# Altium project NES Console.PrjPCB
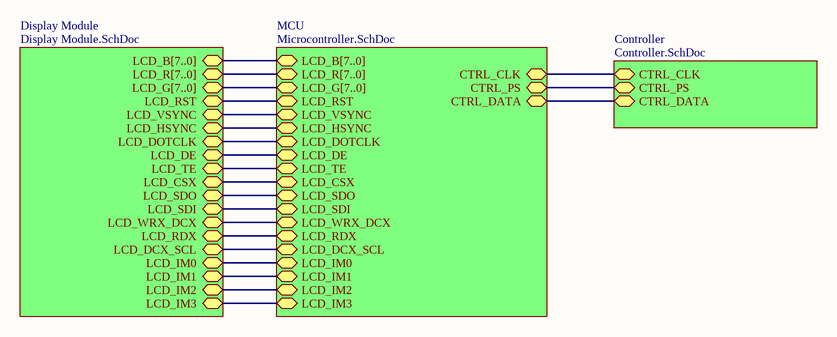
[diagram p0: System Diagram.SchDoc]
4 sheets, 101 parts. Net scope: hierarchical (ports join the sheet entries above them; power ports are global).
Board file: NES Emulator PCB.PcbDoc
Sheets:
  System Diagram.SchDoc
    MCU = Microcontroller.SchDoc
    Controller = Controller.SchDoc
    Display Module = Display Module.SchDoc

## Sheet System Diagram.SchDoc
size A

### Sub-sheets
Controller = Controller.SchDoc: CTRL_CLK (bidir), CTRL_PS (bidir), CTRL_DATA (bidir)
Display Module = Display Module.SchDoc: LCD_B[7..0] (bidir), LCD_R[7..0] (bidir), LCD_G[7..0] (bidir), LCD_RST (bidir), LCD_VSYNC (bidir), LCD_HSYNC (bidir), LCD_DOTCLK (bidir), LCD_DE (bidir), LCD_TE (bidir), LCD_CSX (bidir), LCD_SDO (bidir), LCD_SDI (bidir), LCD_WRX_DCX (bidir), LCD_RDX (bidir), LCD_DCX_SCL (bidir), LCD_IM0 (bidir), LCD_IM1 (bidir), LCD_IM2 (bidir), LCD_IM3 (bidir)
MCU = Microcontroller.SchDoc: LCD_B[7..0] (bidir), LCD_R[7..0] (bidir), LCD_G[7..0] (bidir), LCD_RST (bidir), LCD_VSYNC (bidir), LCD_HSYNC (bidir), LCD_DOTCLK (bidir), LCD_DE (bidir), LCD_TE (bidir), LCD_CSX (bidir), LCD_SDO (bidir), LCD_SDI (bidir), LCD_WRX_DCX (bidir), LCD_RDX (bidir), LCD_DCX_SCL (bidir), LCD_IM0 (bidir), LCD_IM1 (bidir), LCD_IM2 (bidir), LCD_IM3 (bidir), CTRL_PS (bidir), CTRL_CLK (bidir), CTRL_DATA (bidir)

### Nets
DOTCLK: sheet MCU/LCD_DOTCLK, sheet Display Module/LCD_DOTCLK
LCD_CSX: sheet MCU/LCD_CSX, sheet Display Module/LCD_CSX
LCD_DCX: sheet MCU/LCD_DCX_SCL, sheet Display Module/LCD_DCX_SCL
LCD_DE: sheet MCU/LCD_DE, sheet Display Module/LCD_DE
LCD_HSYNC: sheet MCU/LCD_HSYNC, sheet Display Module/LCD_HSYNC
LCD_IM0: sheet MCU/LCD_IM0, sheet Display Module/LCD_IM0
LCD_IM1: sheet MCU/LCD_IM1, sheet Display Module/LCD_IM1
LCD_IM2: sheet MCU/LCD_IM2, sheet Display Module/LCD_IM2
LCD_IM3: sheet MCU/LCD_IM3, sheet Display Module/LCD_IM3
LCD_RDX: sheet MCU/LCD_RDX, sheet Display Module/LCD_RDX
LCD_RST: sheet MCU/LCD_RST, sheet Display Module/LCD_RST
LCD_SDI: sheet MCU/LCD_SDI, sheet Display Module/LCD_SDI
LCD_SDO: sheet MCU/LCD_SDO, sheet Display Module/LCD_SDO
LCD_TE: sheet MCU/LCD_TE, sheet Display Module/LCD_TE
LCD_VSYNC: sheet MCU/LCD_VSYNC, sheet Display Module/LCD_VSYNC
LCD_WRX: sheet MCU/LCD_WRX_DCX, sheet Display Module/LCD_WRX_DCX
PE2: sheet MCU/CTRL_CLK, sheet Controller/CTRL_CLK
PE4: sheet MCU/CTRL_PS, sheet Controller/CTRL_PS
NetP9_1: sheet MCU/CTRL_DATA, sheet Controller/CTRL_DATA

### Buses and harness runs
bus sheet Display Module/LCD_B[7..0] = sheet MCU/LCD_B[7..0]
bus sheet Display Module/LCD_G[7..0] = sheet MCU/LCD_G[7..0]
bus sheet Display Module/LCD_R[7..0] = sheet MCU/LCD_R[7..0]

## Sheet Microcontroller.SchDoc
size A3
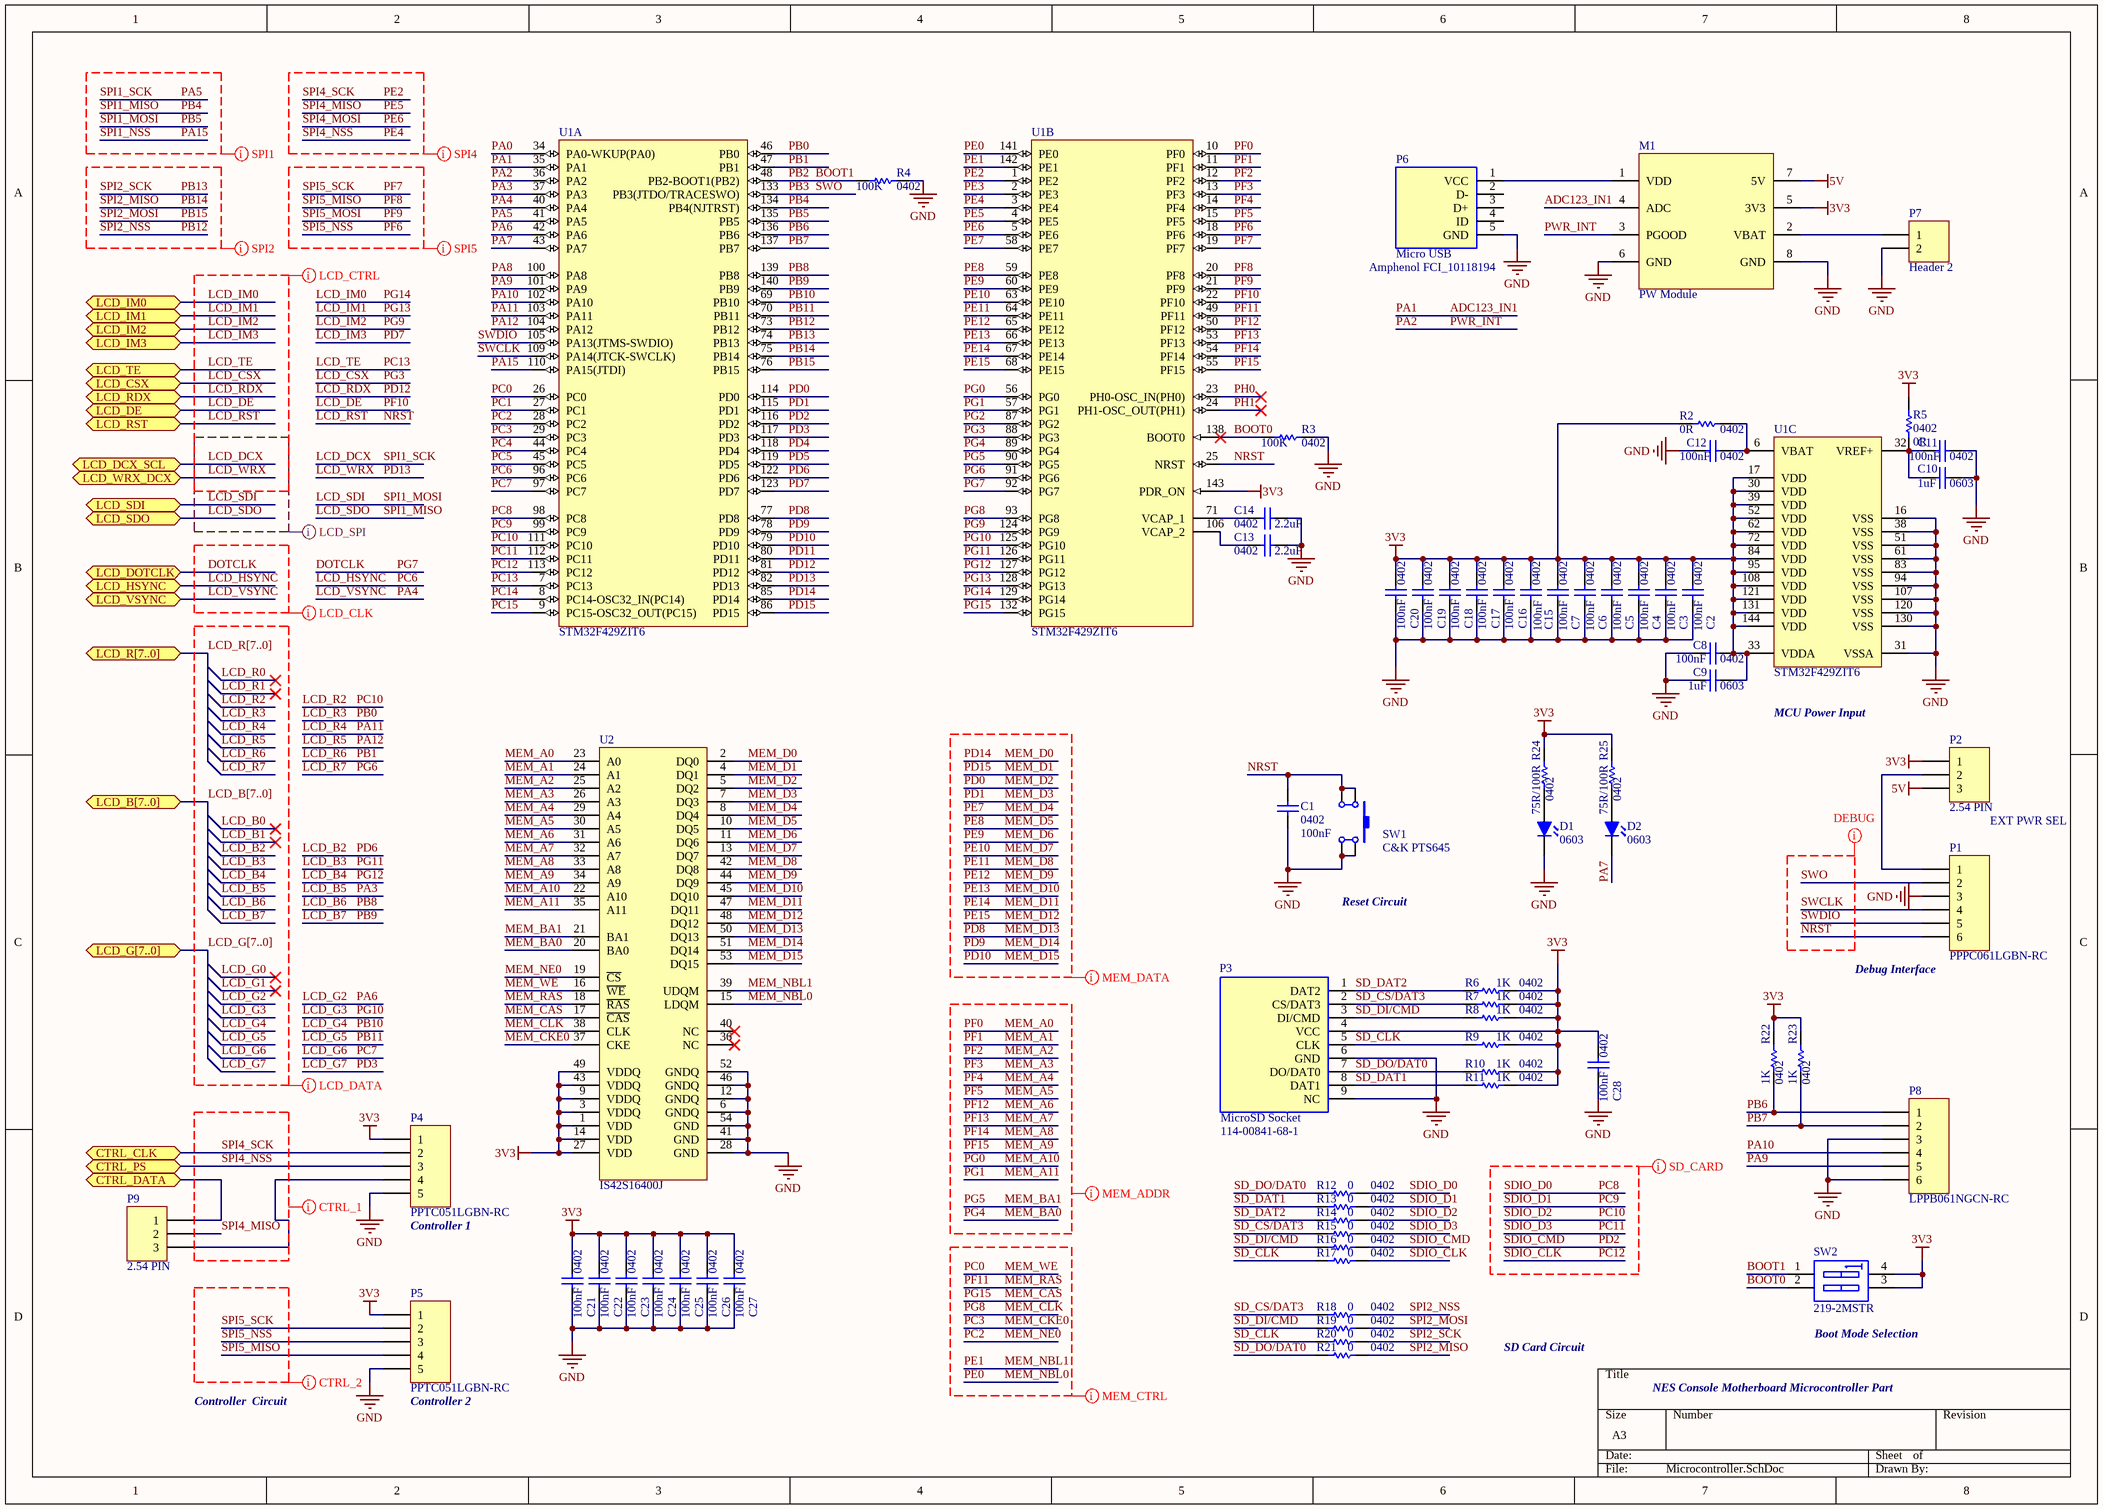
[diagram p1: Microcontroller.SchDoc]

### Parts
C1  0402  value 100nF  [CAPC1005X07N]
C2  0402  value 100nF  [CAPC1005X07N]
C3  0402  value 100nF  [CAPC1005X07N]
C4  0402  value 100nF  [CAPC1005X07N]
C5  0402  value 100nF  [CAPC1005X07N]
C6  0402  value 100nF  [CAPC1005X07N]
C7  0402  value 100nF  [CAPC1005X07N]
C8  0402  value 100nF  [CAPC1005X07N]
C9  0603  value 1uF  [CAPC1608X10N]
C10  0603  value 1uF  [CAPC1608X10N]
C11  0402  value 100nF  [CAPC1005X07N]
C12  0402  value 100nF  [CAPC1005X07N]
C13  0402  value 2.2uF  [CAPC1005X07N]
C14  0402  value 2.2uF  [CAPC1005X07N]
C15  0402  value 100nF  [CAPC1005X07N]
C16  0402  value 100nF  [CAPC1005X07N]
C17  0402  value 100nF  [CAPC1005X07N]
C18  0402  value 100nF  [CAPC1005X07N]
C19  0402  value 100nF  [CAPC1005X07N]
C20  0402  value 100nF  [CAPC1005X07N]
C21  0402  value 100nF  [CAPC1005X07N]
C22  0402  value 100nF  [CAPC1005X07N]
C23  0402  value 100nF  [CAPC1005X07N]
C24  0402  value 100nF  [CAPC1005X07N]
C25  0402  value 100nF  [CAPC1005X07N]
C26  0402  value 100nF  [CAPC1005X07N]
C27  0402  value 100nF  [CAPC1005X07N]
C28  0402  value 100nF  [CAPC1005X07N]
D1  0603  [RESC1608X06N]
D2  0603  [RESC1608X06N]
M1  PW Module  [Power Module]
P1  PPPC061LGBN-RC  [HDR1X6_RANG]
P2  2.54 PIN  [HDR1X3]
P3  114-00841-68-1  Connector Type: MicroSD Socket  [Amphenol_114-00841-68]
P4  PPTC051LGBN-RC  [HDR1X5_RANG]
P5  PPTC051LGBN-RC  [HDR1X5_RANG]
P6  Amphenol FCI_10118194  Connector Type: Micro USB  [USB_Mirco_Amphenol FCI_10118194]
P7  Header 2  [HDR1X2]
P8  LPPB061NGCN-RC  [MHDR1X6_RANG]
P9  2.54 PIN  [HDR1X3]
R2  0402  value 0R  [RESC1005X04N]
R3  0402  value 100K  [RESC1005X04N]
R4  0402  value 100K  [RESC1005X04N]
R5  0402  value 0R  [RESC1005X04N]
R6  0402  value 1K  [RESC1005X04N]
R7  0402  value 1K  [RESC1005X04N]
R8  0402  value 1K  [RESC1005X04N]
R9  0402  value 1K  [RESC1005X04N]
R10  0402  value 1K  [RESC1005X04N]
R11  0402  value 1K  [RESC1005X04N]
R12  0402  value 0  [RESC1005X04N]
R13  0402  value 0  [RESC1005X04N]
R14  0402  value 0  [RESC1005X04N]
R15  0402  value 0  [RESC1005X04N]
R16  0402  value 0  [RESC1005X04N]
R17  0402  value 0  [RESC1005X04N]
R18  0402  value 0  [RESC1005X04N]
R19  0402  value 0  [RESC1005X04N]
R20  0402  value 0  [RESC1005X04N]
R21  0402  value 0  [RESC1005X04N]
R22  0402  value 1K  [RESC1005X04N]
R23  0402  value 1K  [RESC1005X04N]
R24  0402  value 75R/100R  [RESC1005X04N]
R25  0402  value 75R/100R  [RESC1005X04N]
SW1  C&K PTS645  [C&K_PTS645_SMT]
SW2  219-2MSTR  [CTS_219-2_SMT]
U1  STM32F429ZIT6  [STM-LQFP144_N]  (parts A,B,C of 3)
U2  IS42S16400J  [TSOP80P1180X120-54N]

### Ports
CTRL_CLK (bidir), CTRL_DATA (bidir), CTRL_PS (bidir), LCD_B[7..0] (bidir), LCD_CSX (bidir), LCD_DCX_SCL (bidir), LCD_DE (bidir), LCD_DOTCLK (bidir), LCD_G[7..0] (bidir), LCD_HSYNC (bidir), LCD_IM0 (bidir), LCD_IM1 (bidir), LCD_IM2 (bidir), LCD_IM3 (bidir), LCD_R[7..0] (bidir), LCD_RDX (bidir), LCD_RST (bidir), LCD_SDI (bidir), LCD_SDO (bidir), LCD_TE (bidir), LCD_VSYNC (bidir), LCD_WRX_DCX (bidir)

### Nets
3V3: C2.2 C3.2 C4.2 C5.2 C6.2 C7.2 C8.1 C9.1 C15.1 C16.1 C17.1 C18.1 C19.1 C20.1 C21.1 C22.1 C23.1 C24.1 C25.1 C26.1 C27.1 C28.1 M1.5(3V3) P2.1 P3.4(VCC) P4.1 P5.1 R2.2 R5.1 R6.1 R7.1 R8.1 R9.1 R10.1 R11.1 R22.1 R23.1 R24.1 R25.1 SW2.3(B2) SW2.4(B1) U1.17(VDD) U1.30(VDD) U1.33(VDDA) U1.39(VDD) U1.52(VDD) U1.62(VDD) U1.72(VDD) U1.84(VDD) U1.95(VDD) U1.108(VDD) U1.121(VDD) U1.131(VDD) U1.143(PDR_ON) U1.144(VDD) U2.1(VDD) U2.3(VDDQ) U2.9(VDDQ) U2.14(VDD) U2.27(VDD) U2.43(VDDQ) U2.49(VDDQ)
5V: M1.7(5V) P2.3
GND: C1.1 C2.1 C3.1 C4.1 C5.1 C6.1 C7.1 C8.2 C9.2 C10.1 C11.1 C12.2 C13.2 C14.2 C15.2 C16.2 C17.2 C18.2 C19.2 C20.2 C21.2 C22.2 C23.2 C24.2 C25.2 C26.2 C27.2 C28.2 D1.2(-) M1.6(GND) M1.8(GND) P1.3 P3.6(GND) P3.9(NC) P4.5 P5.5 P6.5(GND) P7.2 P8.3 P8.6 R3.1 R4.1 SW1.3 SW1.4 U1.16(VSS) U1.31(VSSA) U1.38(VSS) U1.51(VSS) U1.61(VSS) U1.83(VSS) U1.94(VSS) U1.107(VSS) U1.120(VSS) U1.130(VSS) U2.6(GNDQ) U2.12(GNDQ) U2.28(GND) U2.41(GND) U2.46(GNDQ) U2.52(GNDQ) U2.54(GND)
ADC123_IN1: M1.4(ADC) U1.35(PA1)  [also labelled PA1]
BOOT0: R3.2 SW2.2(A2) U1.138(BOOT0)
BOOT1: R4.2 SW2.1(A1) U1.48(PB2-BOOT1(PB2))  [also labelled PB2]
DOTCLK: U1.92(PG7) ; port LCD_DOTCLK  [also labelled PG7]
LCD_B2: U1.122(PD6)  [also labelled PD6]
LCD_B3: U1.126(PG11)  [also labelled PG11]
LCD_B4: U1.127(PG12)  [also labelled PG12]
LCD_B5: U1.37(PA3)  [also labelled PA3]
LCD_B6: U1.139(PB8)  [also labelled PB8]
LCD_B7: U1.140(PB9)  [also labelled PB9]
LCD_CSX: U1.88(PG3) ; port LCD_CSX  [also labelled PG3]
LCD_DCX: U1.41(PA5) ; port LCD_DCX_SCL  [also labelled PA5, SPI1_SCK]
LCD_DE: U1.22(PF10) ; port LCD_DE  [also labelled PF10]
LCD_G2: U1.42(PA6)  [also labelled PA6]
LCD_G3: U1.125(PG10)  [also labelled PG10]
LCD_G4: U1.69(PB10)  [also labelled PB10]
LCD_G5: U1.70(PB11)  [also labelled PB11]
LCD_G6: U1.97(PC7)  [also labelled PC7]
LCD_G7: U1.117(PD3)  [also labelled PD3]
LCD_HSYNC: U1.96(PC6) ; port LCD_HSYNC  [also labelled PC6]
LCD_IM0: U1.129(PG14) ; port LCD_IM0  [also labelled PG14]
LCD_IM1: U1.128(PG13) ; port LCD_IM1  [also labelled PG13]
LCD_IM2: U1.124(PG9) ; port LCD_IM2  [also labelled PG9]
LCD_IM3: U1.123(PD7) ; port LCD_IM3  [also labelled PD7]
LCD_R2: R14.1 U1.111(PC10)  [also labelled PC10, SDIO_D2]
LCD_R3: U1.46(PB0)  [also labelled PB0]
LCD_R4: U1.103(PA11)  [also labelled PA11]
LCD_R5: U1.104(PA12)  [also labelled PA12]
LCD_R6: U1.47(PB1)  [also labelled PB1]
LCD_R7: U1.91(PG6)  [also labelled PG6]
LCD_RDX: U1.81(PD12) ; port LCD_RDX  [also labelled PD12]
LCD_RST: C1.2 P1.6 SW1.1 SW1.2 U1.25(NRST) ; port LCD_RST  [also labelled NRST]
LCD_SDI: U1.135(PB5) ; port LCD_SDI  [also labelled PB5, SPI1_MOSI]
LCD_SDO: U1.134(PB4(NJTRST)) ; port LCD_SDO  [also labelled PB4, SPI1_MISO]
LCD_TE: U1.7(PC13) ; port LCD_TE  [also labelled PC13]
LCD_VSYNC: U1.40(PA4) ; port LCD_VSYNC  [also labelled PA4]
LCD_WRX: U1.82(PD13) ; port LCD_WRX_DCX  [also labelled PD13]
MEM_A0: U1.10(PF0) U2.23(A0)  [also labelled PF0]
MEM_A1: U1.11(PF1) U2.24(A1)  [also labelled PF1]
MEM_A2: U1.12(PF2) U2.25(A2)  [also labelled PF2]
MEM_A3: U1.13(PF3) U2.26(A3)  [also labelled PF3]
MEM_A4: U1.14(PF4) U2.29(A4)  [also labelled PF4]
MEM_A5: U1.15(PF5) U2.30(A5)  [also labelled PF5]
MEM_A6: U1.50(PF12) U2.31(A6)  [also labelled PF12]
MEM_A7: U1.53(PF13) U2.32(A7)  [also labelled PF13]
MEM_A8: U1.54(PF14) U2.33(A8)  [also labelled PF14]
MEM_A9: U1.55(PF15) U2.34(A9)  [also labelled PF15]
MEM_A10: U1.56(PG0) U2.22(A10)  [also labelled PG0]
MEM_A11: U1.57(PG1) U2.35(A11)  [also labelled PG1]
MEM_BA0: U1.89(PG4) U2.20(BA0)  [also labelled PG4]
MEM_BA1: U1.90(PG5) U2.21(BA1)  [also labelled PG5]
MEM_CAS: U1.132(PG15) U2.17(~{CAS})  [also labelled PG15]
MEM_CKE0: U1.29(PC3) U2.37(CKE)  [also labelled PC3]
MEM_CLK: U1.93(PG8) U2.38(CLK)  [also labelled PG8]
MEM_D0: U1.85(PD14) U2.2(DQ0)  [also labelled PD14]
MEM_D1: U1.86(PD15) U2.4(DQ1)  [also labelled PD15]
MEM_D2: U1.114(PD0) U2.5(DQ2)  [also labelled PD0]
MEM_D3: U1.115(PD1) U2.7(DQ3)  [also labelled PD1]
MEM_D4: U1.58(PE7) U2.8(DQ4)  [also labelled PE7]
MEM_D5: U1.59(PE8) U2.10(DQ5)  [also labelled PE8]
MEM_D6: U1.60(PE9) U2.11(DQ6)  [also labelled PE9]
MEM_D7: U1.63(PE10) U2.13(DQ7)  [also labelled PE10]
MEM_D8: U1.64(PE11) U2.42(DQ8)  [also labelled PE11]
MEM_D9: U1.65(PE12) U2.44(DQ9)  [also labelled PE12]
MEM_D10: U1.66(PE13) U2.45(DQ10)  [also labelled PE13]
MEM_D11: U1.67(PE14) U2.47(DQ11)  [also labelled PE14]
MEM_D12: U1.68(PE15) U2.48(DQ12)  [also labelled PE15]
MEM_D13: U1.77(PD8) U2.50(DQ13)  [also labelled PD8]
MEM_D14: U1.78(PD9) U2.51(DQ14)  [also labelled PD9]
MEM_D15: U1.79(PD10) U2.53(DQ15)  [also labelled PD10]
MEM_NBL0: U1.141(PE0) U2.15(LDQM)  [also labelled PE0]
MEM_NBL1: U1.142(PE1) U2.39(UDQM)  [also labelled PE1]
MEM_NE0: U1.28(PC2) U2.19(~{CS})  [also labelled PC2]
MEM_RAS: U1.49(PF11) U2.18(~{RAS})  [also labelled PF11]
MEM_WE: U1.26(PC0) U2.16(~{WE})  [also labelled PC0]
PA0: U1.34(PA0-WKUP(PA0))
PA2: M1.3(PGOOD) U1.36(PA2)  [also labelled PWR_INT]
PA7: D2.2(-) U1.43(PA7)
PA8: U1.100(PA8)
PA9: P8.5 U1.101(PA9)
PA10: P8.4 U1.102(PA10)
PA15: U1.110(PA15(JTDI))  [also labelled SPI1_NSS]
PB3: P1.2 U1.133(PB3(JTDO/TRACESWO))  [also labelled SWO]
PB6: P8.1 R22.2 U1.136(PB6)
PB7: P8.2 R23.2 U1.137(PB7)
PB12: R18.1 U1.73(PB12)  [also labelled SPI2_NSS]
PB13: R20.1 U1.74(PB13)  [also labelled SPI2_SCK]
PB14: R21.1 U1.75(PB14)  [also labelled SPI2_MISO]
PB15: R19.1 U1.76(PB15)  [also labelled SPI2_MOSI]
PC1: U1.27(PC1)
PC4: U1.44(PC4)
PC5: U1.45(PC5)
PC8: R12.1 U1.98(PC8)  [also labelled SDIO_D0]
PC9: R13.1 U1.99(PC9)  [also labelled SDIO_D1]
PC11: R15.1 U1.112(PC11)  [also labelled SDIO_D3]
PC12: R17.1 U1.113(PC12)  [also labelled SDIO_CLK]
PC14: U1.8(PC14-OSC32_IN(PC14))
PC15: U1.9(PC15-OSC32_OUT(PC15))
PD2: R16.1 U1.116(PD2)  [also labelled SDIO_CMD]
PD4: U1.118(PD4)
PD5: U1.119(PD5)
PD11: U1.80(PD11)
PE2: P4.2 U1.1(PE2) ; port CTRL_CLK  [also labelled SPI4_SCK]
PE3: U1.2(PE3)
PE4: P4.3 U1.3(PE4) ; port CTRL_PS  [also labelled SPI4_NSS]
PE5: P9.2 U1.4(PE5)  [also labelled SPI4_MISO]
PE6: U1.5(PE6)  [also labelled SPI4_MOSI]
PF6: P5.3 U1.18(PF6)  [also labelled SPI5_NSS]
PF7: P5.2 U1.19(PF7)  [also labelled SPI5_SCK]
PF8: P5.4 U1.20(PF8)  [also labelled SPI5_MISO]
PF9: U1.21(PF9)  [also labelled SPI5_MOSI]
PG2: U1.87(PG2)
PH0: U1.23(PH0-OSC_IN(PH0))
PH1: U1.24(PH1-OSC_OUT(PH1))
SD_CLK: P3.5(CLK) R9.2 R17.2 R20.2
SD_CS/DAT3: P3.2(CS/DAT3) R7.2 R15.2 R18.2
SD_DAT1: P3.8(DAT1) R11.2 R13.2
SD_DAT2: P3.1(DAT2) R6.2 R14.2
SD_DI/CMD: P3.3(DI/CMD) R8.2 R16.2 R19.2
SD_DO/DAT0: P3.7(DO/DAT0) R10.2 R12.2 R21.2
SWCLK: P1.4 U1.109(PA14(JTCK-SWCLK))
SWDIO: P1.5 U1.105(PA13(JTMS-SWDIO))
NetC10_2: C10.2 C11.2 R5.2 U1.32(VREF+)
NetC12_1: C12.1 R2.1 U1.6(VBAT)
NetC13_1: C13.1 U1.106(VCAP_2)
NetC14_1: C14.1 U1.71(VCAP_1)
NetD1_1: D1.1(+) R24.2
NetD2_1: D2.1(+) R25.2
NetM1_1: M1.1(VDD) P6.1(VCC)
NetM1_2: M1.2(VBAT) P7.1
NetP1_1: P1.1 P2.2
NetP4_4: P4.4 P9.3
NetP9_1: P9.1 ; port CTRL_DATA

Not connected (* = marked no-connect by the designer): P6 2(D-) 3(D+) 4(ID); U2 36(NC)* 40(NC)*

### Buses and harness runs
bus LCD_B[7..0] = port LCD_B[7..0]
bus LCD_G[7..0] = port LCD_G[7..0]
bus LCD_R[7..0] = port LCD_R[7..0]

### Layout directives
net class MCU_DEBUG: NRST, SWCLK, SWDIO, SWO
net class LCD_DATA: LCD_B0, LCD_B1, LCD_B2, LCD_B3, LCD_B4, LCD_B5, LCD_B6, LCD_B7, LCD_B[7..0], LCD_G0, LCD_G1, LCD_G2, LCD_G3, LCD_G4, LCD_G5, LCD_G6, LCD_G7, LCD_G[7..0], LCD_R0, LCD_R1, LCD_R2, LCD_R3, LCD_R4, LCD_R5, LCD_R6, LCD_R7, LCD_R[7..0]
net class MEM_ADDR: MEM_A0, MEM_A1, MEM_A2, MEM_A3, MEM_A4, MEM_A5, MEM_A6, MEM_A7, MEM_A8, MEM_A9, MEM_A10, MEM_A11, MEM_BA0, MEM_BA1, PF0, PF1, PF2, PF3, PF4, PF5, PF12, PF13, PF14, PF15, PG0, PG1, PG4, PG5
net class MEM_DATA: MEM_D0, MEM_D1, MEM_D2, MEM_D3, MEM_D4, MEM_D5, MEM_D6, MEM_D7, MEM_D8, MEM_D9, MEM_D10, MEM_D11, MEM_D12, MEM_D13, MEM_D14, MEM_D15, PD0, PD1, PD8, PD9, PD10, PD14, PD15, PE7, PE8, PE9, PE10, PE11, PE12, PE13, PE14, PE15
net class MEM_CTRL: MEM_CAS, MEM_CKE0, MEM_CLK, MEM_NBL0, MEM_NBL1, MEM_NE0, MEM_RAS, MEM_WE, PC0, PC2, PC3, PE0, PE1, PF11, PG8, PG15
net class SD_CARD: PC8, PC9, PC10, PC11, PC12, PD2, SDIO_CLK, SDIO_CMD, SDIO_D0, SDIO_D1, SDIO_D2, SDIO_D3
net class LCD_SPI: LCD_DCX, LCD_SDI, LCD_SDO, LCD_WRX
net class LCD_CLK: DOTCLK, LCD_HSYNC, LCD_VSYNC
net class LCD_CTRL: LCD_CSX, LCD_DCX, LCD_DE, LCD_IM0, LCD_IM1, LCD_IM2, LCD_IM3, LCD_RDX, LCD_RST, LCD_TE, LCD_WRX
net class SPI2: PB12, PB13, PB14, PB15, SPI2_MISO, SPI2_MOSI, SPI2_NSS, SPI2_SCK
net class SPI1: PA5, PA15, PB4, PB5, SPI1_MISO, SPI1_MOSI, SPI1_NSS, SPI1_SCK
net class SPI4: PE2, PE4, PE5, PE6, PF6, PF7, PF8, PF9, SPI4_MISO, SPI4_MOSI, SPI4_NSS, SPI4_SCK, SPI5_MISO, SPI5_MOSI, SPI5_NSS, SPI5_SCK
net class CTRL_1: SPI4_MISO, SPI4_NSS, SPI4_SCK
net class CTRL_2: SPI5_MISO, SPI5_NSS, SPI5_SCK

### Notes on the sheet
- MCU Power Input
- EXT PWR SEL
- Reset Circuit
- Debug Interface
- (near P4) Controller 1
- SD Card Circuit
- NES Console Motherboard Microcontroller Part
- (near SW2) Boot Mode Selection
- Controller  Circuit
- (near P5) Controller 2

### Library data of the parts
C1-C28 = Cap: Capacitor; Published: 8-Jun-2000; LatestRevisionDate: 17-Jul-2002; LatestRevisionNote: Re-released for DXP Platform.; PackageReference: RAD-0.3; Publisher: Altium Limited; PackageDescription: Radial Cap, Thru-Hole; 2 Leads; 0.3 in Pin Spacing
D1 D2 = LED-1: General LED
M1 = PW Module: Power Supply Module
P1 P8 = Header 6: Header, 6-Pin; LatestRevisionDate: 17-Jul-2002; LatestRevisionNote: Re-released for DXP Platform.; Publisher: Altium Limited
P2 P9 = Header 3: Header, 3-Pin; LatestRevisionDate: 17-Jul-2002; LatestRevisionNote: Re-released for DXP Platform.; Publisher: Altium Limited
P3 = Amphenol 114-00841-68-1: CONN MICRO SD CARD PUSH-PULL R/A; Manufacturer: Amphenol Commercial; Number of Contacts: 8; Gender: Receptacle; Pitch: 1.1mm; Supplier 1: Digi-Key; Manufacturer Part Number: 114-00841-68; Stock 1: 71075; Pricing 1: 1=1.31, 10=1.188, 25=1.1156, 50=1.0672, 100=1.0187, 250=0.9217, 500=0.8489 (USD); Mount: Surface Mount; Contact Material: Copper,Copper Alloy; Contact Plating: Gold; Housing Material: Polymer; Orientation: Right Angle; Package Quantity: 1; Packaging: Tape and Reel; Number of Rows: 1; Termination: SMD/SMT; Length: 15.6mm; Height: 1.55mm; Depth: 11.45mm; Radiation Hardening: No; REACH SVHC: Unknown; Lead Free: Lead Free; Flammability Rating: UL94 V-0; ComponentLink1URL: https://media.digikey.com/pdf/Data%20Sheets/Amphenol%20PDFs/114-00841-68.pdf?src-supplier=Digi-Key; ComponentLink1Description: https://media.digikey.com/pdf/Data%20Sheets/Amphenol%20PDFs/114-00841-68.pdf?src-supplier=Digi-Key; ComponentLink2URL: http://www.mouser.com/ds/2/18/11400841-283410.pdf?src-supplier=Mouser; ComponentLink2Description: http://www.mouser.com/ds/2/18/11400841-283410.pdf?src-supplier=Mouser; ComponentLink3URL: http://www.newark.com/pdfs/datasheets/Amphenol/11400841.pdf?src-supplier=Element14; ComponentLink3Description: http://www.newark.com/pdfs/datasheets/Amphenol/11400841.pdf?src-supplier=Element14; ComponentLink4URL: http://www.amphenolcanada.com/ProductSearch/drawings/AC/1140084168.pdf?src-supplier=Avnet; ComponentLink4Description: http://www.amphenolcanada.com/ProductSearch/drawings/AC/1140084168.pdf?src-supplier=Avnet; ComponentLink5URL: http://www.alliedelec.com/images/products/datasheets/bm/AMPHENOL_CANADA/70323450.pdf?src-supplier=Allied+Electronics; ComponentLink5Description: http://www.alliedelec.com/images/products/datasheets/bm/AMPHENOL_CANADA/70323450.pdf?src-supplier=Allied+Electronics
P4 P5 = Header 5: Header, 5-Pin; LatestRevisionDate: 17-Jul-2002; LatestRevisionNote: Re-released for DXP Platform.; Publisher: Altium Limited
P6 = CONN_MICRO_USB: General  Micro USB; Manufacture P/N: *
P7 = Header 2: Header, 2-Pin; LatestRevisionDate: 17-Jul-2002; LatestRevisionNote: Re-released for DXP Platform.; Publisher: Altium Limited
R2-R25 = Res1: Resistor; Published: 8-Jun-2000; LatestRevisionDate: 17-Jul-2002; LatestRevisionNote: Re-released for DXP Platform.; PackageReference: AXIAL-0.3; Publisher: Altium Limited; PackageDescription: Axial Device, Thru-Hole; 2 Leads; 0.3 in Pin Spacing
SW1 = SW_TACT: General Tactile Switch
SW2 = SW_DIP-2: DIP Switch, 2 Position, SPST; Published: 24-Mar-1999; LatestRevisionDate: 17-Jul-2002; LatestRevisionNote: Re-released for DXP Platform.; PackageReference: DIP-4; Publisher: Altium Limited
U1 = STM32F429ZIT6: ARM Cortex-M4 32-bit MCU+FPU, 225 DMIPS, 2048 kB Flash, 256 kB Internal RAM, 114 I/Os, 144-pin LQFP, -40 to 85 degC, Tray; Manufacturer: STMicroelectronics; D/A Converter: 2x12-bit; FLASH Size (Prog) (kB): 2048; I/Os (High Current): 114; Internal RAM Size (kB): 256; Operating Frequency(F) (Processor speed) (MHz): 180; Supply Voltage(Vcc) max (V): 3.6; Supply Voltage(Vcc) min (V): 1.8; DatasheetVersion: Rev. 2; PackageVersion: Rev. 4, 06/2013; PackageReference: LQFP144; PackageDescription: 144-Pin Low Profile Quad Flat Package, 20 x 20 mm Body, 0.5 mm Pitch; Supplier 1: Digi-Key; Supplier Part Number 1: 497-14053-ND; Supplier 2: Newark; Supplier Part Number 2: 06X3676; Supplier 3: Mouser; Supplier Part Number 3: 511-STM32F429ZIT6; Core: ARM Cortex-M4; Packing: Tray; Mounting Technology: Surface Mount; PartNumber: STM32F429ZIT6; ComponentLink1Description: Manufacturer URL; ComponentLink1URL: http://www.st.com/web/en/home.html; ComponentLink2Description: Datasheet; ComponentLink2URL: http://www.st.com/st-web-ui/static/active/en/resource/technical/document/data_brief/DM00053488.pdf; ComponentLink3Description: Package Specification; ComponentLink3URL: http://www.st.com/st-web-ui/static/active/en/resource/technical/document/datasheet/DM00037051.pdf
U2 = IS42S16400J: DRAM 64M (4Mx16) 166MHz SDR SDRAM, 3.3V; Manufacturer: ISSI; Manufacturer Part Number: IS42S16400J-6TLI; Access Time: 5.4ns; Max Supply Voltage: 3.6V; Min Supply Voltage: 3V; Data Bus Width: 16b; Memory Size: 64Mb; Memory Type: RAM,SDRAM; Interface: Parallel; Address Bus Width: 14b; Nominal Supply Current: 100mA; Supplier 1: Avnet; Stock 1: 1136; Pricing 1: 1=1.29, 10=1.29, 25=1.29, 50=1.19, 100=1.19 (USD); Mount: Surface Mount; Case/Package: TSOP; Number of Pins: 54; Min Operating Temperature: -40°C; Max Operating Temperature: 85°C; Packaging: Tray; Package Quantity: 108; Frequency: 166MHz; Max Frequency: 166MHz; Operating Supply Voltage: 3.3V; Density: 64Mb; Radiation Hardening: No; Lead Free: Lead Free; ComponentLink1URL: https://www.verical.com/server-webapp/html/getDatasheet?partID=783875&src-supplier=Verical; ComponentLink1Description: https://www.verical.com/server-webapp/html/getDatasheet?partID=783875&src-supplier=Verical

## Sheet Controller.SchDoc
size A
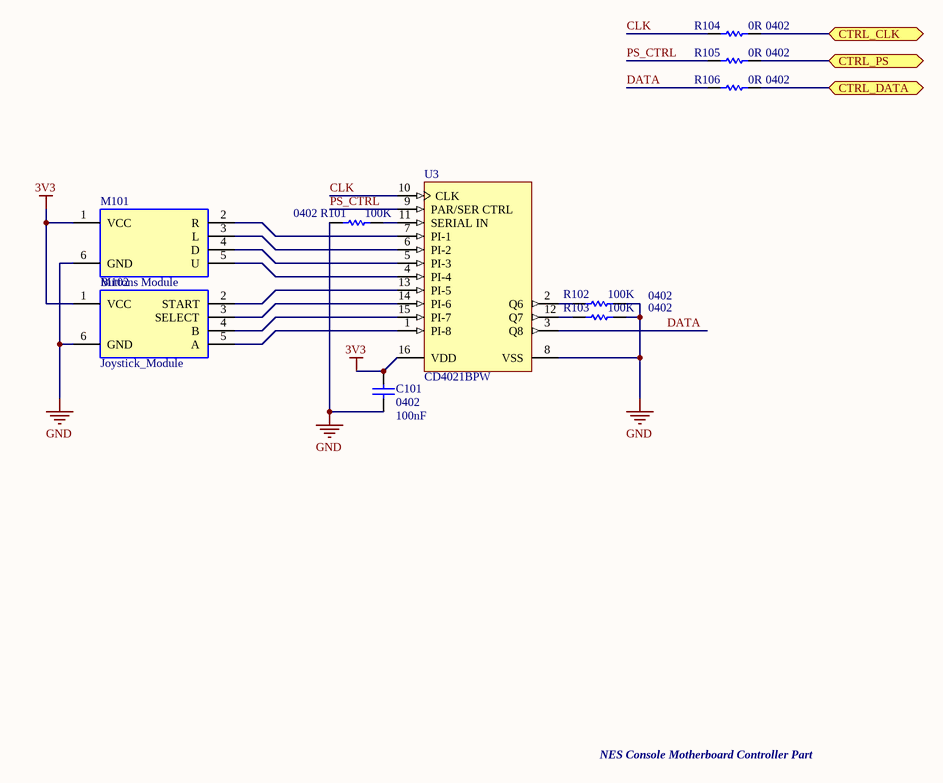
[diagram p2: Controller.SchDoc]

### Parts
C101  0402  value 100nF  [CAPC1005X06N]
M101  Buttons Module  [BUTTON_MODULE]
M102  Joystick_Module  [Joystick_Module]
R101  0402  value 100K  [RESC1005X04N]
R102  0402  value 100K  [RESC1005X04N]
R103  0402  value 100K  [RESC1005X04N]
R104  0402  value 0R  [RESC1005X04N]
R105  0402  value 0R  [RESC1005X04N]
R106  0402  value 0R  [RESC1005X04N]
U3  CD4021BPW  [PW0016A_N]

### Ports
CTRL_CLK (bidir), CTRL_DATA (bidir), CTRL_PS (bidir)

### Nets
3V3: C101.2 M101.1(VCC) M102.1(VCC) U3.16(VDD)
GND: C101.1 M101.6(GND) M102.6(GND) R101.2 R102.1 R103.1 U3.8(VSS)
CLK: R104.2 U3.10(CLK)
DATA: R106.2 U3.3(Q8)
PE2: R104.1 ; port CTRL_CLK
PE4: R105.1 ; port CTRL_PS
PS_CTRL: R105.2 U3.9(PAR/SER_CTRL)
NetM101_2: M101.2(R) U3.7(PI-1)
NetM101_3: M101.3(L) U3.6(PI-2)
NetM101_4: M101.4(D) U3.5(PI-3)
NetM101_5: M101.5(U) U3.4(PI-4)
NetM102_2: M102.2(START) U3.13(PI-5)
NetM102_3: M102.3(SELECT) U3.14(PI-6)
NetM102_4: M102.4(B) U3.15(PI-7)
NetM102_5: M102.5(A) U3.1(PI-8)
NetP9_1: R106.1 ; port CTRL_DATA
NetR101_1: R101.1 U3.11(SERIAL_IN)
NetR102_2: R102.2 U3.2(Q6)
NetR103_2: R103.2 U3.12(Q7)

### Notes on the sheet
- NES Console Motherboard Controller Part

### Library data of the parts
C101 = Cap: Capacitor; Published: 8-Jun-2000; LatestRevisionDate: 17-Jul-2002; LatestRevisionNote: Re-released for DXP Platform.; PackageReference: RAD-0.3; Publisher: Altium Limited; PackageDescription: Radial Cap, Thru-Hole; 2 Leads; 0.3 in Pin Spacing
M101 = Buttons Module: Controller Buttons Module
M102 = Joystick Module: Controller Joystick module
R101-R106 = Res1: Resistor; Published: 8-Jun-2000; LatestRevisionDate: 17-Jul-2002; LatestRevisionNote: Re-released for DXP Platform.; PackageReference: AXIAL-0.3; Publisher: Altium Limited; PackageDescription: Axial Device, Thru-Hole; 2 Leads; 0.3 in Pin Spacing
U3 = CD4021BPW: CMOS 8-Stage Static Shift Register, PW0016A, TUBE; Manufacturer: Texas Instruments; Technology Family: CD4000; VCC(Min)(V): 3; VCC(Max)(V): 18; Voltage(Nom)(V): 10; F @ Nom Voltage(Max)(Mhz): 8; ICC @ Nom Voltage(Max)(mA): 0.3; tpd @ Nom Voltage(Max)(ns): 160; Output Drive (IOL/IOH)(Max)(mA): 1.5/-1.5; 3-State Output: No; Rating: Military; Bits: 4; DatasheetVersion: SCHS024C; PackageReference: PW0016A; Generic Part Number: CD4021B; Input Type: CMOS; Output Type: CMOS; Operating Temperature Range(C): -55 to 125; Code_JEDEC: MO-153; PartNumber: CD4021BPW; ComponentLink1Description: Manufacturer URL; ComponentLink1URL: http://www.ti.com/; ComponentLink2Description: Datasheet; ComponentLink2URL: http://www.ti.com/lit/ds/symlink/cd4021b.pdf; ComponentLink3Description: Package Specification; ComponentLink3URL: http://www.ti.com/lit/ml/mpds361/mpds361.pdf

## Sheet Display Module.SchDoc
size A
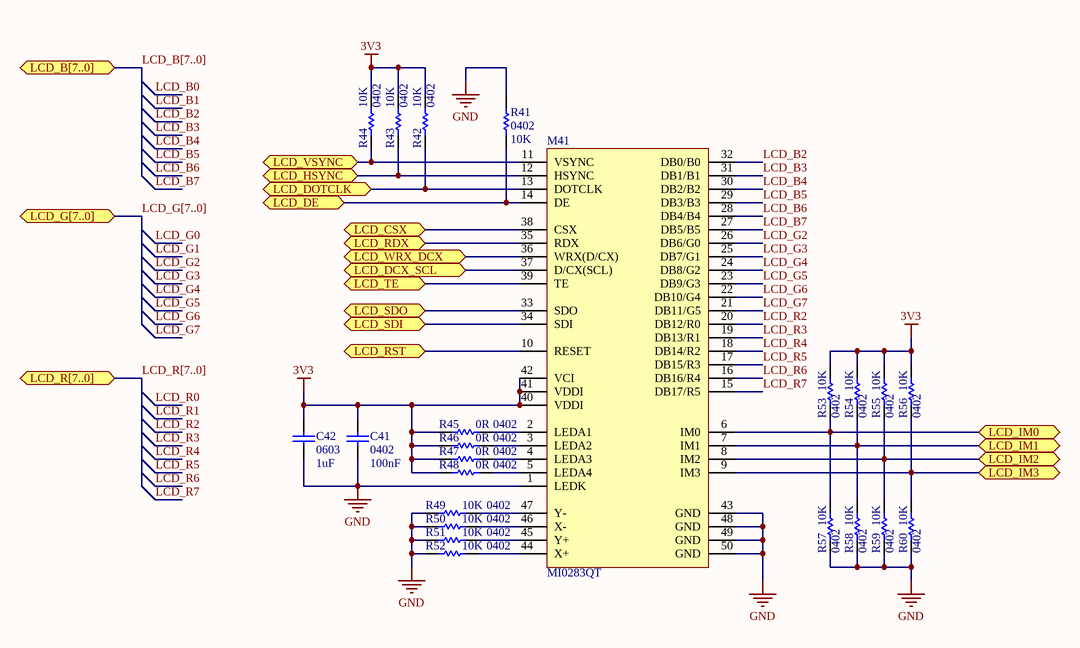
[diagram p3: Display Module.SchDoc]

### Parts
C41  0402  value 100nF  [CAPC1005X06N]
C42  0603  value 1uF  [CAPC1608X10N]
M41  MI0283QT  [2.8_SCREEN_MODULE_SKT]
R41  0402  value 10K  [RESC1005X04N]
R42  0402  value 10K  [RESC1005X04N]
R43  0402  value 10K  [RESC1005X04N]
R44  0402  value 10K  [RESC1005X04N]
R45  0402  value 0R  [RESC1005X04N]
R46  0402  value 0R  [RESC1005X04N]
R47  0402  value 0R  [RESC1005X04N]
R48  0402  value 0R  [RESC1005X04N]
R49  0402  value 10K  [RESC1005X04N]
R50  0402  value 10K  [RESC1005X04N]
R51  0402  value 10K  [RESC1005X04N]
R52  0402  value 10K  [RESC1005X04N]
R53  0402  value 10K  [RESC1005X04N]
R54  0402  value 10K  [RESC1005X04N]
R55  0402  value 10K  [RESC1005X04N]
R56  0402  value 10K  [RESC1005X04N]
R57  0402  value 10K  [RESC1005X04N]
R58  0402  value 10K  [RESC1005X04N]
R59  0402  value 10K  [RESC1005X04N]
R60  0402  value 10K  [RESC1005X04N]

### Ports
LCD_B[7..0] (bidir), LCD_CSX (bidir), LCD_DCX_SCL (bidir), LCD_DE (bidir), LCD_DOTCLK (bidir), LCD_G[7..0] (bidir), LCD_HSYNC (bidir), LCD_IM0 (bidir), LCD_IM1 (bidir), LCD_IM2 (bidir), LCD_IM3 (bidir), LCD_R[7..0] (bidir), LCD_RDX (bidir), LCD_RST (bidir), LCD_SDI (bidir), LCD_SDO (bidir), LCD_TE (bidir), LCD_VSYNC (bidir), LCD_WRX_DCX (bidir)

### Nets
3V3: C41.2 C42.2 M41.40(VDDI) M41.41(VDDI) M41.42(VCI) R42.1 R43.1 R44.1 R45.2 R46.2 R47.2 R48.2 R53.1 R54.1 R55.1 R56.1
GND: C41.1 C42.1 M41.1(LEDK) M41.43(GND) M41.48(GND) M41.49(GND) M41.50(GND) R41.1 R49.2 R50.2 R51.2 R52.2 R57.2 R58.2 R59.2 R60.2
DOTCLK: M41.13(DOTCLK) R42.2 ; port LCD_DOTCLK
LCD_B2: M41.32(DB0/B0)
LCD_B3: M41.31(DB1/B1)
LCD_B4: M41.30(DB2/B2)
LCD_B5: M41.29(DB3/B3)
LCD_B6: M41.28(DB4/B4)
LCD_B7: M41.27(DB5/B5)
LCD_CSX: M41.38(CSX) ; port LCD_CSX
LCD_DCX: M41.37(D/CX(SCL)) ; port LCD_DCX_SCL
LCD_DE: M41.14(DE) R41.2 ; port LCD_DE
LCD_G2: M41.26(DB6/G0)
LCD_G3: M41.25(DB7/G1)
LCD_G4: M41.24(DB8/G2)
LCD_G5: M41.23(DB9/G3)
LCD_G6: M41.22(DB10/G4)
LCD_G7: M41.21(DB11/G5)
LCD_HSYNC: M41.12(HSYNC) R43.2 ; port LCD_HSYNC
LCD_IM0: M41.6(IM0) R53.2 R57.1 ; port LCD_IM0
LCD_IM1: M41.7(IM1) R54.2 R58.1 ; port LCD_IM1
LCD_IM2: M41.8(IM2) R55.2 R59.1 ; port LCD_IM2
LCD_IM3: M41.9(IM3) R56.2 R60.1 ; port LCD_IM3
LCD_R2: M41.20(DB12/R0)
LCD_R3: M41.19(DB13/R1)
LCD_R4: M41.18(DB14/R2)
LCD_R5: M41.17(DB15/R3)
LCD_R6: M41.16(DB16/R4)
LCD_R7: M41.15(DB17/R5)
LCD_RDX: M41.35(RDX) ; port LCD_RDX
LCD_RST: M41.10(RESET) ; port LCD_RST
LCD_SDI: M41.34(SDI) ; port LCD_SDI
LCD_SDO: M41.33(SDO) ; port LCD_SDO
LCD_TE: M41.39(TE) ; port LCD_TE
LCD_VSYNC: M41.11(VSYNC) R44.2 ; port LCD_VSYNC
LCD_WRX: M41.36(WRX(D/CX)) ; port LCD_WRX_DCX
NetM41_2: M41.2(LEDA1) R45.1
NetM41_3: M41.3(LEDA2) R46.1
NetM41_4: M41.4(LEDA3) R47.1
NetM41_5: M41.5(LEDA4) R48.1
NetM41_44: M41.44(X+) R52.1
NetM41_45: M41.45(Y+) R51.1
NetM41_46: M41.46(X-) R50.1
NetM41_47: M41.47(Y-) R49.1

### Buses and harness runs
bus LCD_B[7..0] = port LCD_B[7..0]
bus LCD_G[7..0] = port LCD_G[7..0]
bus LCD_R[7..0] = port LCD_R[7..0]

### Library data of the parts
C41 C42 = Cap: Capacitor; Published: 8-Jun-2000; LatestRevisionDate: 17-Jul-2002; LatestRevisionNote: Re-released for DXP Platform.; PackageReference: RAD-0.3; Publisher: Altium Limited; PackageDescription: Radial Cap, Thru-Hole; 2 Leads; 0.3 in Pin Spacing
M41 = Screen Module
R41-R60 = Res1: Resistor; Published: 8-Jun-2000; LatestRevisionDate: 17-Jul-2002; LatestRevisionNote: Re-released for DXP Platform.; PackageReference: AXIAL-0.3; Publisher: Altium Limited; PackageDescription: Axial Device, Thru-Hole; 2 Leads; 0.3 in Pin Spacing

## Nets that join several sheets
3V3: Microcontroller (62 pins), Controller (C101.2 M101.1 M102.1 U3.16), Display Module (16 pins)
GND: Microcontroller (61 pins), Controller (7 pins), Display Module (16 pins)
DOTCLK: Microcontroller (U1.92), Display Module (M41.13 R42.2)
LCD_B2: Microcontroller (U1.122), Display Module (M41.32)
LCD_B3: Microcontroller (U1.126), Display Module (M41.31)
LCD_B4: Microcontroller (U1.127), Display Module (M41.30)
LCD_B5: Microcontroller (U1.37), Display Module (M41.29)
LCD_B6: Microcontroller (U1.139), Display Module (M41.28)
LCD_B7: Microcontroller (U1.140), Display Module (M41.27)
LCD_CSX: Microcontroller (U1.88), Display Module (M41.38)
LCD_DCX: Microcontroller (U1.41), Display Module (M41.37)
LCD_DE: Microcontroller (U1.22), Display Module (M41.14 R41.2)
LCD_G2: Microcontroller (U1.42), Display Module (M41.26)
LCD_G3: Microcontroller (U1.125), Display Module (M41.25)
LCD_G4: Microcontroller (U1.69), Display Module (M41.24)
LCD_G5: Microcontroller (U1.70), Display Module (M41.23)
LCD_G6: Microcontroller (U1.97), Display Module (M41.22)
LCD_G7: Microcontroller (U1.117), Display Module (M41.21)
LCD_HSYNC: Microcontroller (U1.96), Display Module (M41.12 R43.2)
LCD_IM0: Microcontroller (U1.129), Display Module (M41.6 R53.2 R57.1)
LCD_IM1: Microcontroller (U1.128), Display Module (M41.7 R54.2 R58.1)
LCD_IM2: Microcontroller (U1.124), Display Module (M41.8 R55.2 R59.1)
LCD_IM3: Microcontroller (U1.123), Display Module (M41.9 R56.2 R60.1)
LCD_R2: Microcontroller (R14.1 U1.111), Display Module (M41.20)
LCD_R3: Microcontroller (U1.46), Display Module (M41.19)
LCD_R4: Microcontroller (U1.103), Display Module (M41.18)
LCD_R5: Microcontroller (U1.104), Display Module (M41.17)
LCD_R6: Microcontroller (U1.47), Display Module (M41.16)
LCD_R7: Microcontroller (U1.91), Display Module (M41.15)
LCD_RDX: Microcontroller (U1.81), Display Module (M41.35)
LCD_RST: Microcontroller (5 pins), Display Module (M41.10)
LCD_SDI: Microcontroller (U1.135), Display Module (M41.34)
LCD_SDO: Microcontroller (U1.134), Display Module (M41.33)
LCD_TE: Microcontroller (U1.7), Display Module (M41.39)
LCD_VSYNC: Microcontroller (U1.40), Display Module (M41.11 R44.2)
LCD_WRX: Microcontroller (U1.82), Display Module (M41.36)
NetP9_1: Microcontroller (P9.1), Controller (R106.1)
PE2: Microcontroller (P4.2 U1.1), Controller (R104.1)
PE4: Microcontroller (P4.3 U1.3), Controller (R105.1)